# Altium schematic sheet 08_DRAM_LPDDR4.SchDoc: DRAM_LPDDR4
size 420 x 297 mm; Author: Lukas Henkel; DocumentNumber: 8; SheetNumber: 8; SheetTotal: 16; DocSize: A3
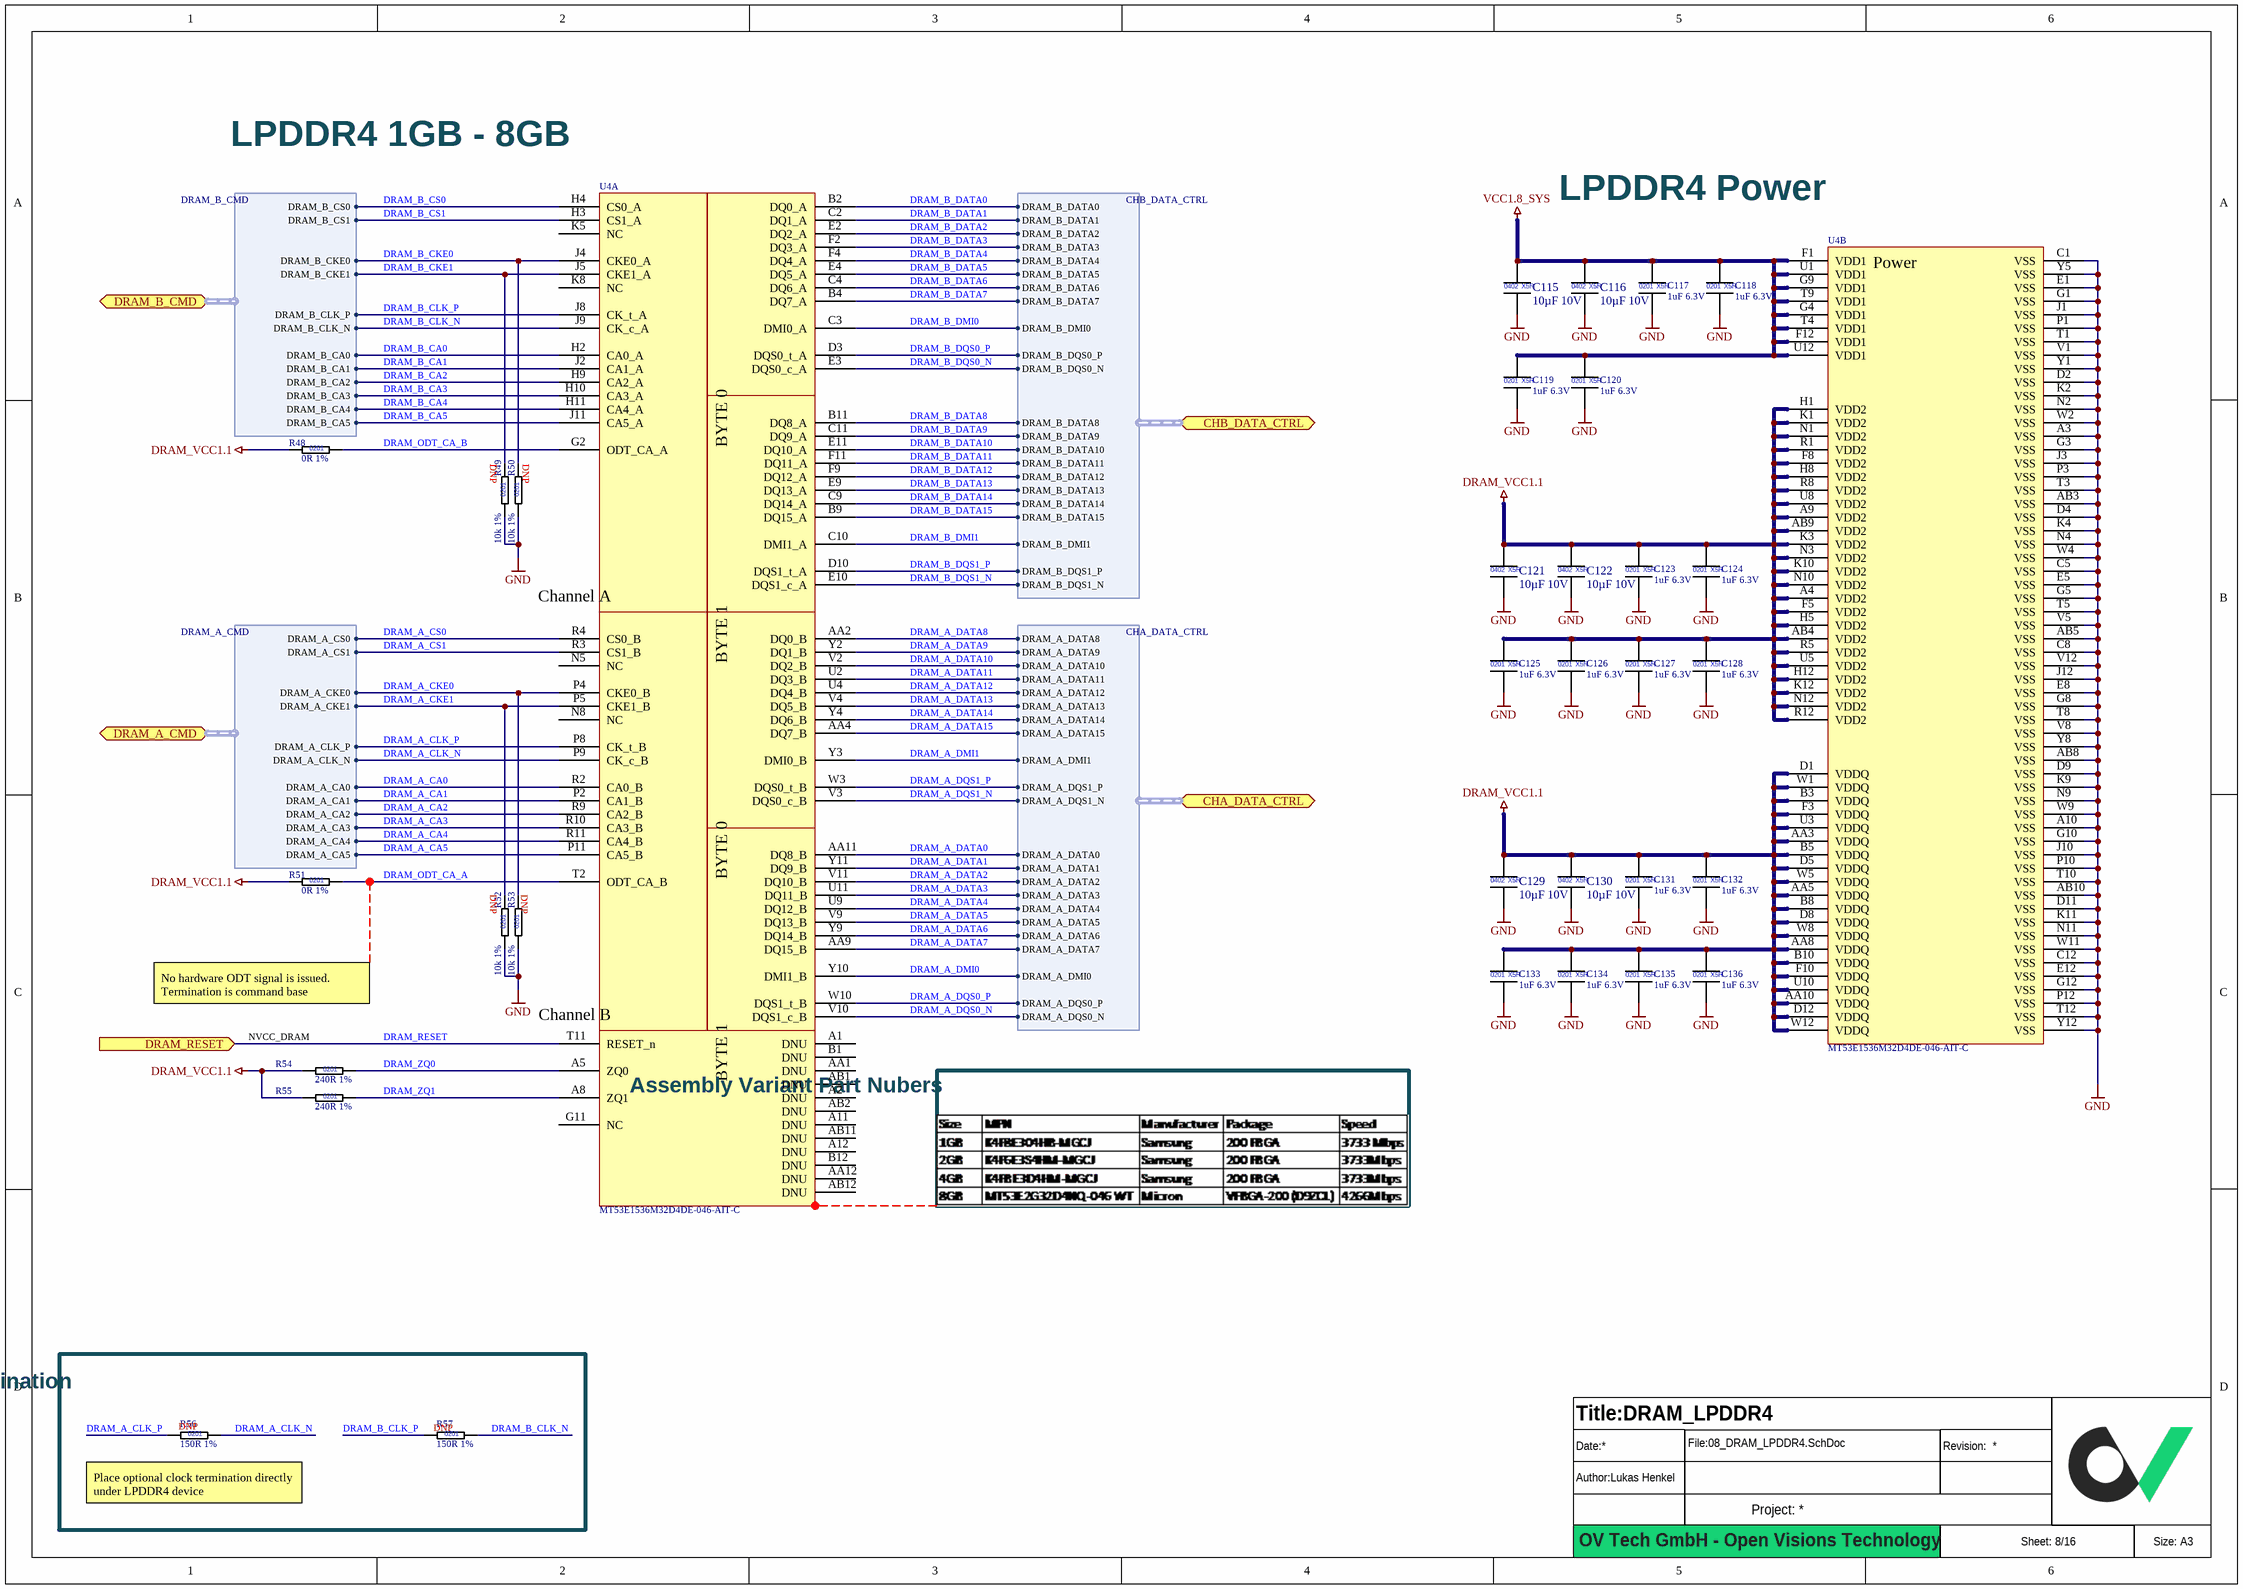
[diagram p0: 08_DRAM_LPDDR4.SchDoc]

## Parts
?  (no value)  (graphical)
C115  10µF 10V  [CAPC1005X06L]
C116  10µF 10V  [CAPC1005X06L]
C117  1uF 6.3V  [CAPC0603X03L]
C118  1uF 6.3V  [CAPC0603X03L]
C119  1uF 6.3V  [CAPC0603X03L]
C120  1uF 6.3V  [CAPC0603X03L]
C121  10µF 10V  [CAPC1005X06L]
C122  10µF 10V  [CAPC1005X06L]
C123  1uF 6.3V  [CAPC0603X03L]
C124  1uF 6.3V  [CAPC0603X03L]
C125  1uF 6.3V  [CAPC0603X03L]
C126  1uF 6.3V  [CAPC0603X03L]
C127  1uF 6.3V  [CAPC0603X03L]
C128  1uF 6.3V  [CAPC0603X03L]
C129  10µF 10V  [CAPC1005X06L]
C130  10µF 10V  [CAPC1005X06L]
C131  1uF 6.3V  [CAPC0603X03L]
C132  1uF 6.3V  [CAPC0603X03L]
C133  1uF 6.3V  [CAPC0603X03L]
C134  1uF 6.3V  [CAPC0603X03L]
C135  1uF 6.3V  [CAPC0603X03L]
C136  1uF 6.3V  [CAPC0603X03L]
R48  0R 1%  [RESC0603X03L]
R49  10k 1%  [RESC0603X03L]  (no BOM)
R50  10k 1%  [RESC0603X03L]  (no BOM)
R51  0R 1%  [RESC0603X03L]
R52  10k 1%  [RESC0603X03L]  (no BOM)
R53  10k 1%  [RESC0603X03L]  (no BOM)
R54  240R 1%  [RESC0603X03L]
R55  240R 1%  [RESC0603X03L]
R56  150R 1%  [RESC0603X03L]  (no BOM)
R57  150R 1%  [RESC0603X03L]  (no BOM)
U4  MT53E1536M32D4DE-046-AIT-C  [BGA200C65P12X22_1000X1450X114]  (parts A,B of 2)

## Blocks framed on the sheet
Clock Termination: R56 R57

## Ports
CHA_DATA_CTRL (bidir, harness CHA_DATA_CTRL), CHB_DATA_CTRL (bidir, harness CHB_DATA_CTRL), DRAM_A_CMD (bidir, harness DRAM_A_CMD), DRAM_B_CMD (bidir, harness DRAM_B_CMD), DRAM_RESET (in)

## Harnesses
DRAM_A_CMD: DRAM_A_CA0, DRAM_A_CA1, DRAM_A_CA2, DRAM_A_CA3, DRAM_A_CA4, DRAM_A_CA5, DRAM_A_CS0, DRAM_A_CS1, DRAM_A_CKE0, DRAM_A_CKE1, DRAM_A_CLK_P, DRAM_A_CLK_N
DRAM_B_CMD: DRAM_B_CA0, DRAM_B_CA1, DRAM_B_CA2, DRAM_B_CA3, DRAM_B_CA4, DRAM_B_CA5, DRAM_B_CS0, DRAM_B_CS1, DRAM_B_CKE0, DRAM_B_CKE1, DRAM_B_CLK_P, DRAM_B_CLK_N
CHA_DATA_CTRL: DRAM_A_DATA0, DRAM_A_DATA1, DRAM_A_DATA2, DRAM_A_DATA3, DRAM_A_DATA4, DRAM_A_DATA5, DRAM_A_DATA6, DRAM_A_DATA7, DRAM_A_DATA8, DRAM_A_DATA9, DRAM_A_DATA10, DRAM_A_DATA11, DRAM_A_DATA12, DRAM_A_DATA13, DRAM_A_DATA14, DRAM_A_DATA15, DRAM_A_DMI0, DRAM_A_DMI1, DRAM_A_DQS0_P, DRAM_A_DQS0_N, DRAM_A_DQS1_P, DRAM_A_DQS1_N
CHB_DATA_CTRL: DRAM_B_DATA0, DRAM_B_DATA1, DRAM_B_DATA2, DRAM_B_DATA3, DRAM_B_DATA4, DRAM_B_DATA5, DRAM_B_DATA6, DRAM_B_DATA7, DRAM_B_DATA8, DRAM_B_DATA9, DRAM_B_DATA10, DRAM_B_DATA11, DRAM_B_DATA12, DRAM_B_DATA13, DRAM_B_DATA14, DRAM_B_DATA15, DRAM_B_DMI0, DRAM_B_DMI1, DRAM_B_DQS0_P, DRAM_B_DQS0_N, DRAM_B_DQS1_P, DRAM_B_DQS1_N

## Nets
DRAM_VCC1.1: C121.1 C122.1 C123.1 C124.1 C125.1 C126.1 C127.1 C128.1 C129.1 C130.1 C131.1 C132.1 C133.1 C134.1 C135.1 C136.1 R48.1 R51.1 R54.1 R55.1 U4.A4(VDD2) U4.A9(VDD2) U4.AA3(VDDQ) U4.AA5(VDDQ) U4.AA8(VDDQ) U4.AA10(VDDQ) U4.AB4(VDD2) U4.AB9(VDD2) U4.B3(VDDQ) U4.B5(VDDQ) U4.B8(VDDQ) U4.B10(VDDQ) U4.D1(VDDQ) U4.D5(VDDQ) U4.D8(VDDQ) U4.D12(VDDQ) U4.F3(VDDQ) U4.F5(VDD2) U4.F8(VDD2) U4.F10(VDDQ) U4.H1(VDD2) U4.H5(VDD2) U4.H8(VDD2) U4.H12(VDD2) U4.K1(VDD2) U4.K3(VDD2) U4.K10(VDD2) U4.K12(VDD2) U4.N1(VDD2) U4.N3(VDD2) U4.N10(VDD2) U4.N12(VDD2) U4.R1(VDD2) U4.R5(VDD2) U4.R8(VDD2) U4.R12(VDD2) U4.U3(VDDQ) U4.U5(VDD2) U4.U8(VDD2) U4.U10(VDDQ) U4.W1(VDDQ) U4.W5(VDDQ) U4.W8(VDDQ) U4.W12(VDDQ)
GND: C115.2 C116.2 C117.2 C118.2 C119.2 C120.2 C121.2 C122.2 C123.2 C124.2 C125.2 C126.2 C127.2 C128.2 C129.2 C130.2 C131.2 C132.2 C133.2 C134.2 C135.2 C136.2 R49.1 R50.1 R52.1 R53.1 U4.A3(VSS) U4.A10(VSS) U4.AB3(VSS) U4.AB5(VSS) U4.AB8(VSS) U4.AB10(VSS) U4.C1(VSS) U4.C5(VSS) U4.C8(VSS) U4.C12(VSS) U4.D2(VSS) U4.D4(VSS) U4.D9(VSS) U4.D11(VSS) U4.E1(VSS) U4.E5(VSS) U4.E8(VSS) U4.E12(VSS) U4.G1(VSS) U4.G3(VSS) U4.G5(VSS) U4.G8(VSS) U4.G10(VSS) U4.G12(VSS) U4.J1(VSS) U4.J3(VSS) U4.J10(VSS) U4.J12(VSS) U4.K2(VSS) U4.K4(VSS) U4.K9(VSS) U4.K11(VSS) U4.N2(VSS) U4.N4(VSS) U4.N9(VSS) U4.N11(VSS) U4.P1(VSS) U4.P3(VSS) U4.P10(VSS) U4.P12(VSS) U4.T1(VSS) U4.T3(VSS) U4.T5(VSS) U4.T8(VSS) U4.T10(VSS) U4.T12(VSS) U4.V1(VSS) U4.V5(VSS) U4.V8(VSS) U4.V12(VSS) U4.W2(VSS) U4.W4(VSS) U4.W9(VSS) U4.W11(VSS) U4.Y1(VSS) U4.Y5(VSS) U4.Y8(VSS) U4.Y12(VSS)
VCC1.8_SYS: C115.1 C116.1 C117.1 C118.1 C119.1 C120.1 U4.F1(VDD1) U4.F12(VDD1) U4.G4(VDD1) U4.G9(VDD1) U4.T4(VDD1) U4.T9(VDD1) U4.U1(VDD1) U4.U12(VDD1)
DRAM_A_CA0: U4.R2(CA0_B) ; port DRAM_A_CMD.DRAM_A_CA0
DRAM_A_CA1: U4.P2(CA1_B) ; port DRAM_A_CMD.DRAM_A_CA1
DRAM_A_CA2: U4.R9(CA2_B) ; port DRAM_A_CMD.DRAM_A_CA2
DRAM_A_CA3: U4.R10(CA3_B) ; port DRAM_A_CMD.DRAM_A_CA3
DRAM_A_CA4: U4.R11(CA4_B) ; port DRAM_A_CMD.DRAM_A_CA4
DRAM_A_CA5: U4.P11(CA5_B) ; port DRAM_A_CMD.DRAM_A_CA5
DRAM_A_CKE0: R53.2 U4.P4(CKE0_B) ; port DRAM_A_CMD.DRAM_A_CKE0
DRAM_A_CKE1: R52.2 U4.P5(CKE1_B) ; port DRAM_A_CMD.DRAM_A_CKE1
DRAM_A_CLK_N: R56.2 U4.P9(CK_c_B) ; port DRAM_A_CMD.DRAM_A_CLK_N
DRAM_A_CLK_P: R56.1 U4.P8(CK_t_B) ; port DRAM_A_CMD.DRAM_A_CLK_P
DRAM_A_CS0: U4.R4(CS0_B) ; port DRAM_A_CMD.DRAM_A_CS0
DRAM_A_CS1: U4.R3(CS1_B) ; port DRAM_A_CMD.DRAM_A_CS1
DRAM_A_DATA0: U4.AA11(DQ8_B) ; port CHA_DATA_CTRL.DRAM_A_DATA0
DRAM_A_DATA1: U4.Y11(DQ9_B) ; port CHA_DATA_CTRL.DRAM_A_DATA1
DRAM_A_DATA2: U4.V11(DQ10_B) ; port CHA_DATA_CTRL.DRAM_A_DATA2
DRAM_A_DATA3: U4.U11(DQ11_B) ; port CHA_DATA_CTRL.DRAM_A_DATA3
DRAM_A_DATA4: U4.U9(DQ12_B) ; port CHA_DATA_CTRL.DRAM_A_DATA4
DRAM_A_DATA5: U4.V9(DQ13_B) ; port CHA_DATA_CTRL.DRAM_A_DATA5
DRAM_A_DATA6: U4.Y9(DQ14_B) ; port CHA_DATA_CTRL.DRAM_A_DATA6
DRAM_A_DATA7: U4.AA9(DQ15_B) ; port CHA_DATA_CTRL.DRAM_A_DATA7
DRAM_A_DATA8: U4.AA2(DQ0_B) ; port CHA_DATA_CTRL.DRAM_A_DATA8
DRAM_A_DATA9: U4.Y2(DQ1_B) ; port CHA_DATA_CTRL.DRAM_A_DATA9
DRAM_A_DATA10: U4.V2(DQ2_B) ; port CHA_DATA_CTRL.DRAM_A_DATA10
DRAM_A_DATA11: U4.U2(DQ3_B) ; port CHA_DATA_CTRL.DRAM_A_DATA11
DRAM_A_DATA12: U4.U4(DQ4_B) ; port CHA_DATA_CTRL.DRAM_A_DATA12
DRAM_A_DATA13: U4.V4(DQ5_B) ; port CHA_DATA_CTRL.DRAM_A_DATA13
DRAM_A_DATA14: U4.Y4(DQ6_B) ; port CHA_DATA_CTRL.DRAM_A_DATA14
DRAM_A_DATA15: U4.AA4(DQ7_B) ; port CHA_DATA_CTRL.DRAM_A_DATA15
DRAM_A_DMI0: U4.Y10(DMI1_B) ; port CHA_DATA_CTRL.DRAM_A_DMI0
DRAM_A_DMI1: U4.Y3(DMI0_B) ; port CHA_DATA_CTRL.DRAM_A_DMI1
DRAM_A_DQS0_N: U4.V10(DQS1_c_B) ; port CHA_DATA_CTRL.DRAM_A_DQS0_N
DRAM_A_DQS0_P: U4.W10(DQS1_t_B) ; port CHA_DATA_CTRL.DRAM_A_DQS0_P
DRAM_A_DQS1_N: U4.V3(DQS0_c_B) ; port CHA_DATA_CTRL.DRAM_A_DQS1_N
DRAM_A_DQS1_P: U4.W3(DQS0_t_B) ; port CHA_DATA_CTRL.DRAM_A_DQS1_P
DRAM_B_CA0: U4.H2(CA0_A) ; port DRAM_B_CMD.DRAM_B_CA0
DRAM_B_CA1: U4.J2(CA1_A) ; port DRAM_B_CMD.DRAM_B_CA1
DRAM_B_CA2: U4.H9(CA2_A) ; port DRAM_B_CMD.DRAM_B_CA2
DRAM_B_CA3: U4.H10(CA3_A) ; port DRAM_B_CMD.DRAM_B_CA3
DRAM_B_CA4: U4.H11(CA4_A) ; port DRAM_B_CMD.DRAM_B_CA4
DRAM_B_CA5: U4.J11(CA5_A) ; port DRAM_B_CMD.DRAM_B_CA5
DRAM_B_CKE0: R50.2 U4.J4(CKE0_A) ; port DRAM_B_CMD.DRAM_B_CKE0
DRAM_B_CKE1: R49.2 U4.J5(CKE1_A) ; port DRAM_B_CMD.DRAM_B_CKE1
DRAM_B_CLK_N: R57.2 U4.J9(CK_c_A) ; port DRAM_B_CMD.DRAM_B_CLK_N
DRAM_B_CLK_P: R57.1 U4.J8(CK_t_A) ; port DRAM_B_CMD.DRAM_B_CLK_P
DRAM_B_CS0: U4.H4(CS0_A) ; port DRAM_B_CMD.DRAM_B_CS0
DRAM_B_CS1: U4.H3(CS1_A) ; port DRAM_B_CMD.DRAM_B_CS1
DRAM_B_DATA0: U4.B2(DQ0_A) ; port CHB_DATA_CTRL.DRAM_B_DATA0
DRAM_B_DATA1: U4.C2(DQ1_A) ; port CHB_DATA_CTRL.DRAM_B_DATA1
DRAM_B_DATA2: U4.E2(DQ2_A) ; port CHB_DATA_CTRL.DRAM_B_DATA2
DRAM_B_DATA3: U4.F2(DQ3_A) ; port CHB_DATA_CTRL.DRAM_B_DATA3
DRAM_B_DATA4: U4.F4(DQ4_A) ; port CHB_DATA_CTRL.DRAM_B_DATA4
DRAM_B_DATA5: U4.E4(DQ5_A) ; port CHB_DATA_CTRL.DRAM_B_DATA5
DRAM_B_DATA6: U4.C4(DQ6_A) ; port CHB_DATA_CTRL.DRAM_B_DATA6
DRAM_B_DATA7: U4.B4(DQ7_A) ; port CHB_DATA_CTRL.DRAM_B_DATA7
DRAM_B_DATA8: U4.B11(DQ8_A) ; port CHB_DATA_CTRL.DRAM_B_DATA8
DRAM_B_DATA9: U4.C11(DQ9_A) ; port CHB_DATA_CTRL.DRAM_B_DATA9
DRAM_B_DATA10: U4.E11(DQ10_A) ; port CHB_DATA_CTRL.DRAM_B_DATA10
DRAM_B_DATA11: U4.F11(DQ11_A) ; port CHB_DATA_CTRL.DRAM_B_DATA11
DRAM_B_DATA12: U4.F9(DQ12_A) ; port CHB_DATA_CTRL.DRAM_B_DATA12
DRAM_B_DATA13: U4.E9(DQ13_A) ; port CHB_DATA_CTRL.DRAM_B_DATA13
DRAM_B_DATA14: U4.C9(DQ14_A) ; port CHB_DATA_CTRL.DRAM_B_DATA14
DRAM_B_DATA15: U4.B9(DQ15_A) ; port CHB_DATA_CTRL.DRAM_B_DATA15
DRAM_B_DMI0: U4.C3(DMI0_A) ; port CHB_DATA_CTRL.DRAM_B_DMI0
DRAM_B_DMI1: U4.C10(DMI1_A) ; port CHB_DATA_CTRL.DRAM_B_DMI1
DRAM_B_DQS0_N: U4.E3(DQS0_c_A) ; port CHB_DATA_CTRL.DRAM_B_DQS0_N
DRAM_B_DQS0_P: U4.D3(DQS0_t_A) ; port CHB_DATA_CTRL.DRAM_B_DQS0_P
DRAM_B_DQS1_N: U4.E10(DQS1_c_A) ; port CHB_DATA_CTRL.DRAM_B_DQS1_N
DRAM_B_DQS1_P: U4.D10(DQS1_t_A) ; port CHB_DATA_CTRL.DRAM_B_DQS1_P
DRAM_ODT_CA_A: R51.2 U4.T2(ODT_CA_B)
DRAM_ODT_CA_B: R48.2 U4.G2(ODT_CA_A)
DRAM_RESET: U4.T11(RESET_n) ; port DRAM_RESET
DRAM_ZQ0: R54.2 U4.A5(ZQ0)
DRAM_ZQ1: R55.2 U4.A8(ZQ1)

Not connected (* = marked no-connect by the designer): U4 A1(DNU) A2(DNU) A11(DNU) A12(DNU) AA1(DNU) AA12(DNU) AB1(DNU) AB2(DNU) AB11(DNU) AB12(DNU) B1(DNU) B12(DNU) G11(NC) K5(NC) K8(NC) N5(NC) N8(NC)

## Notes on the sheet
- LPDDR4 1GB - 8GB
- LPDDR4 Power
- (near R49) DNP
- (near R50) DNP
- (near R52) DNP
- (near R53) DNP
- No hardware ODT signal is issued. Termination is command base
- (near R54) NVCC_DRAM
- Assembly Variant Part Nubers
- (near R56) DNP
- (near R57) DNP
- (near R56) Place optional clock termination directly under LPDDR4 device
- OV Tech GmbH - Open Visions Technology
- (in symbol CAP_0201_1uF_6.3V) 0201; X5R
- (in symbol CAP_0402_10µ_10V) 0402; X5R
- (in symbol LPDDR4_MT53E1536M32D4DE-046-AIT-C, part A) BYTE 0; Channel A; BYTE 1; Channel B
- (in symbol LPDDR4_MT53E1536M32D4DE-046-AIT-C, part B) Power
- (in symbol RES_0201_0R_1%) 0201
- (in symbol RES_0201_10k_1%) 0201
- (in symbol RES_0201_150R_1%) 0201
- (in symbol RES_0201_240R_1%) 0201

## Library data of the parts
? = Titleblock_01_OpenSource
C115 C116 C121 C122 C129 C130 = CAP_0402_10µ_10V: Multilayer Ceramic Capacitors MLCC - SMD/SMT 0402 10VDC; Manufacturer 1: Murata Electronics; Manufacturer 1 Prt. Nr.: GRM155R61A106ME11D; Manufacturer 2 Prt. Nr.: 0402ZD106MAT4A; Manufacturer 2: KYOCERA AVX
C117-C120 C123-C128 C131-C136 = CAP_0201_1uF_6.3V: Multilayer Ceramic Capacitors MLCC - SMD/SMT 0201 6.3VDC; Manufacturer 1: Murata Electronics; Manufacturer 1 Prt. Nr.: GRM033R60J105MEA2D; Manufacturer 2 Prt. Nr.: CL03A105MQ3CSNC; Manufacturer 2: Samsung Electro-Mechanics
R48 R51 = RES_0201_0R_1%: Thick Film Resistors - SMD 0R OHM 1%; Manufacturer 1: Yageo; Manufacturer 1 Prt. Nr.: RC0201FR-070RL; Manufacturer 2 Prt. Nr.: CRCW02010000Z0ED; Manufacturer 2: Vishay / Dale
R49 R50 R52 R53 = RES_0201_10k_1%: Thick Film Resistors - SMD 10K OHM 1%; Manufacturer 1: Yageo; Manufacturer 1 Prt. Nr.: RC0201FR-0710KL; Manufacturer 2 Prt. Nr.: CRCW020110K0FNED; Manufacturer 2: Vishay / Dale
R54 R55 = RES_0201_240R_1%: Thick Film Resistors - SMD 240 OHM 1%; Manufacturer 1: Yageo; Manufacturer 1 Prt. Nr.: RC0201FR-07240RL; Manufacturer 2 Prt. Nr.: CRCW0201240RFNED; Manufacturer 2: Vishay / Dale
R56 R57 = RES_0201_150R_1%: Thick Film Resistors - SMD 150 OHM 1%; Manufacturer 1: Yageo; Manufacturer 1 Prt. Nr.: RC0201FR-07150RL; Manufacturer 2 Prt. Nr.: CRCW0201150RFNED; Manufacturer 2: Vishay / Dale
U4 = LPDDR4_MT53E1536M32D4DE-046-AIT-C: DRAM LPDDR4 48G 1.5GX32 FBGA QDP; Manufacturer 1: Micron; Manufacturer 1 Prt. Nr.: MT53E1536M32D4DE-046-AIT-C